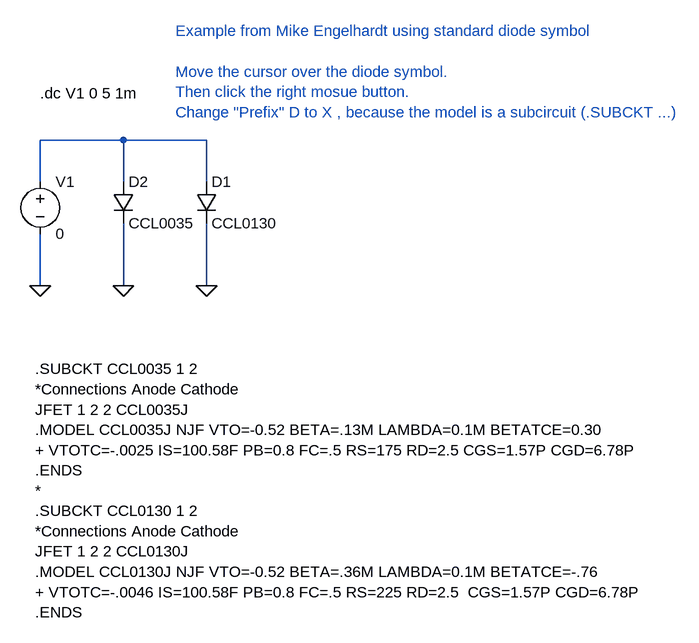
[diagram p0: schematic CurrentReg.asc]
CurrentReg.asc, the LTspice schematic file:
Version 4
SHEET 1 1820 832
WIRE -112 352 -112 272
WIRE -112 192 -112 128
WIRE -112 128 16 128
WIRE 144 128 144 192
WIRE 144 256 144 352
WIRE 16 128 16 192
WIRE 16 256 16 352
WIRE 16 128 144 128
FLAG 144 352 0
FLAG -112 352 0
FLAG 16 352 0
SYMBOL diode 128 192 R0
SYMATTR InstName D1
SYMATTR Value CCL0130
SYMATTR Prefix X
SYMBOL voltage -112 176 R0
SYMATTR InstName V1
SYMATTR Value 0
SYMBOL diode 0 192 R0
SYMATTR InstName D2
SYMATTR Value CCL0035
SYMATTR Prefix X
TEXT -112 56 Left 0 !.dc V1 0 5 1m
TEXT -120 480 Left 0 !.SUBCKT CCL0035 1 2\n*Connections Anode Cathode\nJFET 1 2 2 CCL0035J\n.MODEL CCL0035J NJF VTO=-0.52 BETA=.13M LAMBDA=0.1M BETATCE=0.30\n+ VTOTC=-.0025 IS=100.58F PB=0.8 FC=.5 RS=175 RD=2.5 CGS=1.57P CGD=6.78P\n.ENDS\n*\n.SUBCKT CCL0130 1 2\n*Connections Anode Cathode\nJFET 1 2 2 CCL0130J \n.MODEL CCL0130J NJF VTO=-0.52 BETA=.36M LAMBDA=0.1M BETATCE=-.76 \n+ VTOTC=-.0046 IS=100.58F PB=0.8 FC=.5 RS=225 RD=2.5  CGS=1.57P CGD=6.78P\n.ENDS
TEXT 96 -40 Left 0 ;Example from Mike Engelhardt using standard diode symbol\n \nMove the cursor over the diode symbol. \nThen click the right mosue button.\nChange "Prefix" D to X , because the model is a subcircuit (.SUBCKT ...)

The netlist it stands for:
* CurrentReg.asc
XD1 N001 0 CCL0130  ; pins + -
V1 N001 0 0
XD2 N001 0 CCL0035  ; pins + -
.dc V1 0 5 1m
.SUBCKT CCL0035 1 2
*Connections Anode Cathode
JFET 1 2 2 CCL0035J
.MODEL CCL0035J NJF VTO=-0.52 BETA=.13M LAMBDA=0.1M BETATCE=0.30
+ VTOTC=-.0025 IS=100.58F PB=0.8 FC=.5 RS=175 RD=2.5 CGS=1.57P CGD=6.78P
.ENDS
*
.SUBCKT CCL0130 1 2
*Connections Anode Cathode
JFET 1 2 2 CCL0130J
.MODEL CCL0130J NJF VTO=-0.52 BETA=.36M LAMBDA=0.1M BETATCE=-.76
+ VTOTC=-.0046 IS=100.58F PB=0.8 FC=.5 RS=225 RD=2.5  CGS=1.57P CGD=6.78P
.ENDS
* Example from Mike Engelhardt using standard diode symbol
* Move the cursor over the diode symbol.
* Then click the right mosue button.
* Change "Prefix" D to X , because the model is a subcircuit (.SUBCKT ...)
.backanno
.end